# Altium schematic sheet Sheet1.SchDoc
size A; SheetNumber: 1; SheetTotal: 1
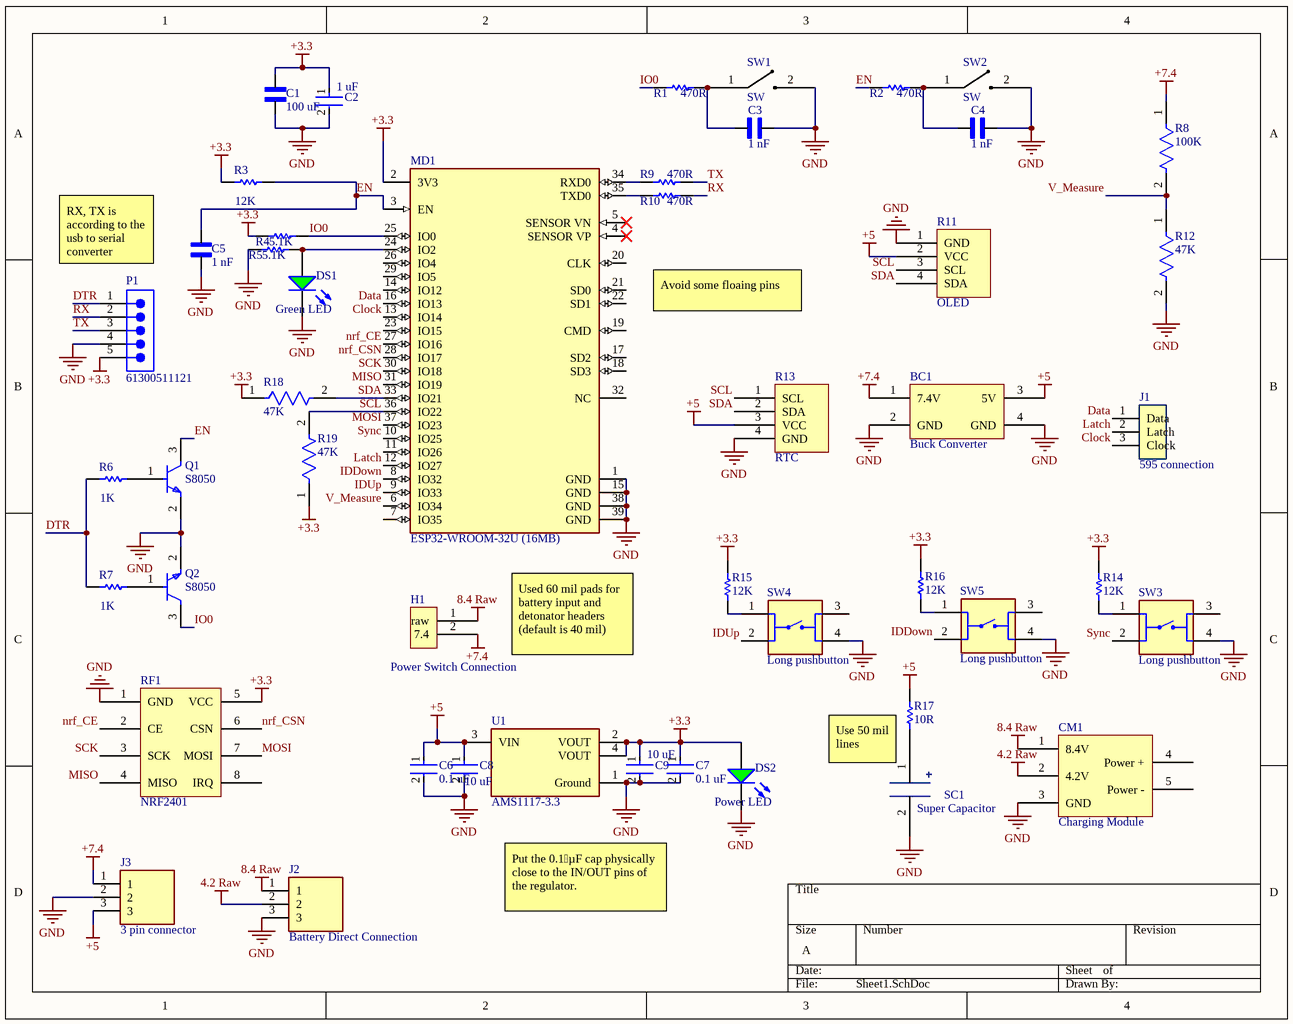
[diagram p0: Sheet1.SchDoc]

## Parts
BC1  Buck Converter  [Buck Converter]
C1  100 uF  [0805 CAP]
C2  1 uF  [FP-CL21-IPC_A]
C3  1 nF  [0805 CAP]
C4  1 nF  [0805 CAP]
C5  1 nF  [0805 CAP]
C6  0.1 uF  [FP-CC0805-0_85-MFG]
C7  0.1 uF  [FP-CC0805-0_85-MFG]
C8  10 uF  [FP-CL21-IPC_A]
C9  10 uF  [FP-CL21-IPC_A]
CM1  Charging Module  [2S Charging Module]
DS1  Green LED  [DIAL-0805-2_V]
DS2  Power LED  [DIAL-0805-2_V]
H1  Power Switch Connection  [2 Pin Header L]
J1  595 connection  [3 pin header]
J2  Battery Direct Connection  [3 pin connector]
J3  3 pin connector  [3 pin connector]
MD1  ESP32-WROOM-32U (16MB)  [FP-ESP32-WROOM-32U_16MB-MFG]
P1  61300511121  [61300511121]
Q1  S8050  [FP-SOT23-IPC_A]
Q2  S8050  [FP-SOT23-IPC_A]
R1  470R  [RESC2013X50X30LL20T20]
R2  470R  [RESC2013X50X30LL20T20]
R3  12K  [RESC2013X50X30LL20T20]
R4  5.1K  [RESC2013X50X30LL20T20]
R5  5.1K  [RESC2013X50X30LL20T20]
R6  1K  [RESC2013X50X30LL20T20]
R7  1K  [RESC2013X50X30LL20T20]
R8  100K  [FP-RC0805-0_6-MFG]
R9  470R  [RESC2013X50X30LL20T20]
R10  470R  [RESC2013X50X30LL20T20]
R11  OLED  [OLED]
R12  47K  [FP-CRCW0805-e3-MFG]
R13  RTC  [RTC]
R14  12K  [RESC2013X50X30LL20T20]
R15  12K  [RESC2013X50X30LL20T20]
R16  12K  [RESC2013X50X30LL20T20]
R17  10R  [RESC2013X50X30LL20T20]
R18  47K  [FP-CRCW0805-e3-MFG]
R19  47K  [FP-CRCW0805-e3-MFG]
RF1  NRF2401  [nrf2401]
SC1  Super Capacitor  [Super Capacitor]
SW1  SW  [smd push button 2]
SW2  SW  [smd push button 2]
SW3  Long pushbutton  [TH PB]
SW4  Long pushbutton  [TH PB]
SW5  Long pushbutton  [TH PB]
U1  AMS1117-3.3  [FP-AMS1117-IPC_C]

## Nets
4.2 Raw: CM1.2(4.2V) J2.2
8.4 Raw: CM1.1(8.4V) H1.1(raw) J2.1
+3.3: C1.2 C2.1 C7.1 C9.1 DS2.1(A) MD1.2(3V3) P1.5 R3.1 R4.1 R14.2 R15.2 R16.2 R18.1 R19.1 RF1.5(VCC) U1.2(VOUT) U1.4(VOUT)
+5: BC1.3(5V) C6.1 C8.1 J3.3 R11.2(VCC) R13.3(VCC) R17.2 U1.3(VIN)
+7.4: BC1.1(7.4V) H1.2(7.4) J3.1 R8.1
GND: BC1.2(GND) BC1.4(GND) C1.1 C2.2 C3.1 C4.1 C5.1 C6.2 C7.2 C8.2 C9.2 CM1.3(GND) DS1.2(K) DS2.2(K) J2.3 J3.2 MD1.1(GND) MD1.15(GND) MD1.38(GND) MD1.39(GND) P1.4 Q1.2(E) Q2.2(E) R5.1 R11.1(GND) R12.2 R13.4(GND) RF1.1(GND) SC1.2 SW1.2 SW2.2 SW3.4 SW4.4 SW5.4 U1.1(Ground)
Clock: J1.3(Clock) MD1.13(IO14)
Data: J1.1(Data) MD1.16(IO13)
DTR: P1.1 R6.1 R7.1
EN: C5.2 MD1.3(EN) Q1.3(C) R2.1 R3.2
IDDown: MD1.8(IO32) SW5.2
IDUp: MD1.9(IO33) SW4.2
IO0: MD1.25(IO0) Q2.3(C) R1.1 R4.2
Latch: J1.2(Latch) MD1.12(IO27)
MISO: MD1.31(IO19) RF1.4(MISO)
MOSI: MD1.37(IO23) RF1.7(MOSI)
nrf_CE: MD1.27(IO16) RF1.2(CE)
nrf_CSN: MD1.28(IO17) RF1.6(CSN)
RX: P1.2 R10.2
SCK: MD1.30(IO18) RF1.3(SCK)
SCL: MD1.36(IO22) R11.3(SCL) R13.1(SCL) R19.2
SDA: MD1.33(IO21) R11.4(SDA) R13.2(SDA) R18.2
Sync: MD1.10(IO25) SW3.2
TX: P1.3 R9.2
V_Measure: MD1.6(IO34) R8.2 R12.1
NetC3_2: C3.2 R1.2 SW1.1
NetC4_2: C4.2 R2.2 SW2.1
NetDS1_1: DS1.1(A) MD1.24(IO2) R5.2
NetMD1_34: MD1.34(RXD0) R9.1
NetMD1_35: MD1.35(TXD0) R10.1
NetQ1_1: Q1.1(B) R6.2
NetQ2_1: Q2.1(B) R7.2
NetR14_1: R14.1 SW3.1
NetR15_1: R15.1 SW4.1
NetR16_1: R16.1 SW5.1
NetR17_1: R17.1 SC1.1

Not connected (* = marked no-connect by the designer): CM1 4(Power_+) 5(Power_-); MD1 4(SENSOR_VP)* 5(SENSOR_VN)* 7(IO35) 11(IO26) 14(IO12) 17(SD2) 18(SD3) 19(CMD) 20(CLK) 21(SD0) 22(SD1) 23(IO15) 26(IO4) 29(IO5) 32(NC); RF1 8(IRQ); SW3 3; SW4 3; SW5 3

## Notes on the sheet
- RX, TX is according to the usb to serial converter
- Avoid some floaing pins
- Used 60 mil pads for battery input and detonator headers (default is 40 mil)
- (near R17) Use 50 mil lines
- Put the 0.1 µF cap physically close to the IN/OUT pins of the regulator.

## Library data of the parts
C1 C3-C5 = 0805 cap: 10000 pF Â±5% 16V Ceramic Capacitor X7R 0805 (2012 Metric); MF: AVX; MP: 0805YC103J4T2A; SnapEDA_Link: https://www.snapeda.com/parts/0805YC103J4T2A/AVX/view-part/?ref=snap; Package: 2012 AVX; Check_prices: https://www.snapeda.com/parts/0805YC103J4T2A/AVX/view-part/?ref=eda
  C1: Value: 100 uF; JLC: C141660
  C3-C5: Value: 1 nF; JLC: C1791
C2 C8 C9 = CMP-13271-002975-1: CL21 Series 0805 10uF 25V ±10% Tolerance X5R Multilayer Ceramic Chip Capacitor; Case Code (Imperial): 0805; Length: 2mm; Case/Package: 0805; Packaging: Tape and Reel; Width: 0.049inch; Tolerance: 10%; Mount: Surface Mount; Min Operating Temperature: -55°C; Thickness: 0.057inch; Height: 1.25mm; Dielectric: X5R; Package Quantity: 1; Depth: 1.25mm; Voltage Rating: 25V; Case Code (Metric): 2012; Max Operating Temperature: 85°C; Radiation Hardening: No
  C2: Capacitance: 1 uF; JLC: C385977
  C8 C9: Capacitance: 10uF; JLC: C15850
C6 C7 = CMP-2100-03606-3: CAP CER 0.1UF 50V X7R 0805; Manufacturer Part Number: CC0805KRX7R9BB104; Manufacturer: Yageo; Tolerance: 0.1; Capacitance: 100 nF; Value: 100 nF; Material: Ceramic; Device Class L1: Passive Components; ComponentLink2Description: Datasheet; Package: CC0805-0.85; Digikey Description: CAP CER 0.1UF 50V X7R 0805; Device Class L3: Ceramic Capacitors; Temperature: -30°C to +85°C; Temperature Characteristic: X7R; Voltage Rating: 50 V; Height: 0.95mm; RoHS: TRUE; Ipc Land Pattern Name: CAPC200125X85; Device Class L2: Capacitors; Category: Cap; Temperature Range Low: -30°C; Temperature Range High: +85°C; Mouser Description: Multilayer Ceramic Capacitors MLCC - SMD/SMT 100nF 50V X7R 10%; Footprint Url: http://www.yageo.com/exep/pages/download/literatures/UPY-C_GEN_24.pdf; Automotive: No; Octopart: https://octopart.com/cc0805krx7r9bb104-yageo-192993; Lead Free: Yes; ComponentLink2URL: http://www.yageo.com/documents/recent/UPY-GPHC_Y5V_6.3V-to-50V_8.pdf; JLC: C476766
CM1 = 2S Charging module
DS1 DS2 = CMP-2000-05655-1: Single Color, 2 V, -30 to 85 degC, 2-Pin SMD (0805), RoHS, Tape and Reel; Manufacturer: Dialight; Main Category: ChipLED; Shape Type: Rectangular; Forward Current: 25mA; Product Length (mm): 2mm; Emitting Color: YellowGreen; Test Current (It): 20mA; Number of  Elements: 1; Luminous Intensity: 20mcd; DELETED: Compliant; Reverse Voltage: 5V; Chip Material: GaP; High Brightness: No; Viewing Angle: 140deg; Dominant Wave Length: 570nm; Type: Uni-Color; Product Depth (mm): 1.25mm; Power Dissipation: 60W; Product Height (mm): 0.7mm; Forward Voltage: 2.4V; Lens Dimensions: 1.4x1.25x0.4mm; Pin Count: 2; Datasheet URL: https://datasheet.ciiva.com/22748/1484480-22748121.pdf; Operating Temperature Classification: Commercial; Package Reference: 0805; Operating Temp Range: -30Cto85C; Mounting: SurfaceMount; Mounting Technology: SurfaceMount; Manufacturer URL: http://www.dialight.com/; Package Description: 2-Pin Surface Mount Device, Body 2 x 1.25 mm; Lum Intensity: 20mcd; Datasheet Version: 10/2008; Rad Hardened: No; Packaging: TapeandReel; Package Type: SMD; JLC: C2297
H1 = 2 pin header
J1 = 3 pin header: 3P,STRAIGHT,SIDE ENTRY,3.5MM; MF: TE Connectivity; MP: 1546551-3; Price: None; SnapEDA_Link: https://www.snapeda.com/parts/1546551-3/TE%20Connectivity%20AMP%20Connectors/view-part/2360652/?ref=snap; Availability: Unavailable; Value: *; Package: None
J2 J3 = 3 pin connector: 3P,STRAIGHT,SIDE ENTRY,3.5MM; MF: TE Connectivity; MP: 1546551-3; Price: None; SnapEDA_Link: https://www.snapeda.com/parts/1546551-3/TE%20Connectivity%20AMP%20Connectors/view-part/2360652/?ref=snap; Availability: Unavailable; Value: *; Package: None
MD1 = CMP-194065-000029-1: RX TXRX MODULE WIFI U.FL SMD; Sensitivity: -98dBm; Frequency: 2.5GHz; Memory Size: 536KB; Data Rate: 150Mbps; Interface: I2C; Packaging: Tape and Reel; Case/Package: SMD/SMT; Max Operating Temperature: 85°C; Mount: Surface Mount; Min Operating Temperature: -40°C; JLC: C328062
P1 = CMP-1502-01068-3: NexarPartId: 32855526; Connector Type: Male Pin; Gender: Male; Contact Resistance: 20mΩ; Pitch: 2.54mm; Operating Supply Voltage: 250V; Current Rating: 3A; Number of Contacts: 5; Lead Free: Lead Free; Color: Black; Packaging: Bulk; Lead Pitch: 2.54mm; Contact Material: Copper; Min Operating Temperature: -40°C; Contact Mating Length: 5.9944mm; Voltage Rating: 250V; Number of Pins: 5; Number of Positions: 5; Height: 8.89mm; Orientation: Vertical; REACH SVHC: Unknown; RoHS: Compliant; Contact Plating: Gold; Max Operating Temperature: 105°C; Mount: Through Hole; Number of Rows: 1; Termination: Solder
Q1 Q2 = CMP-2000-04931-2: TRANS NPN 40V 0.2A SMD SOT23-3; Frequency: 300MHz; Power Dissipation: 350mW; Element Configuration: Single; Max Power Dissipation: 300mW; Max Collector Current: 200mA; Collector Emitter Saturation Voltage: 300mV; Number of Elements: 1; hFE Min: 100; Collector Base Voltage (VCBO): 60V; Emitter Base Voltage (VEBO): 6V; Contact Plating: Tin; Package Quantity: 3000; Max Frequency: 300MHz; REACH SVHC: No SVHC; Max Operating Temperature: 150°C; Width: 1.4mm; Collector Emitter Voltage (VCEO): 40V; Voltage Rating (DC): 40V; Radiation Hardening: No; Case/Package: SOT-23; Height: 1mm; Collector Emitter Breakdown Voltage: 40V; Length: 3.05mm; Polarity: NPN; Packaging: Tape and Reel; Number of Pins: 3; Min Operating Temperature: -55°C; Gain Bandwidth Product: 300MHz; Mount: Surface Mount; Weight: 0.000282oz; Continuous Collector Current: 200mA; Transition Frequency: 300MHz; Max Breakdown Voltage: 40V; Lead Free: Lead Free; JLC: C41095
R1-R7 R9 R10 R14-R17 = CMP-2001-04896-1: Manufacturer: Vishay Dale; Part Number: CRCW08050000Z0EA
  R1 R2 R9 R10: JLC: C17710
  R3 R14-R16: JLC: C17444
  R4 R5: JLC: C27834
  R6 R7: JLC: C17513
  R17: JLC: C17415
R8 = CMP-03412-037835-1: RES SMD 100K OHM 5% 1/8W 0805; Voltage Rating: 150V; Power Rating: 125mW; Temperature Coefficient: 100ppm/°C; Resistance: 100kR; Radiation Hardening: No; Lead Free: Lead Free; Size Code: 0805; Resistance Tolerance: 5%; Case Code (Imperial): 0805; Min Operating Temperature: -55°C; Packaging: Tape and Reel; Termination: SMD/SMT; Number of Terminations: 2; RoHS Compliant: Yes; Features: Moisture Resistant; Construction: Rectangular; Series: RC; Max Operating Temperature: 155°C; Military Standard: Not; Depth: 1.25mm; Contact Plating: Tin; Tolerance: 5%; Max Power Dissipation: 125mW; Length: 2mm; Case Code (Metric): 2012; Resistor Type: Thick Film; Case/Package: 0805; JLC: C149504
R12 R18 R19 = CMP-2001-03939-2: RES Thick Film, 47kΩ, 1%, 0.125W, 100ppm/°C, 0805; Resistance: 47kR; Voltage Rating: 150V; Max Power Dissipation: 125mW; Termination: SMD/SMT; Case Code (Imperial): 0805; Number of Terminations: 2; Contact Plating: Tin; Min Operating Temperature: -55°C; Features: Automotive AEC-Q200; Temperature Coefficient: 100ppm/°C; Case/Package: 0805; Composition: Thick Film; Working Voltage: 150V; Width: 1.25mm; Package Quantity: 10; Lead Free: Lead Free; Radiation Hardening: No; Power Rating: 125mW; Military Standard: Not; Height: 0.45mm; Weight: 0.000194oz; Length: 2mm; Depth: 1.25mm; Voltage Rating (DC): 150V; Packaging: Tape and Reel; Case Code (Metric): 2012; Max Operating Temperature: 155°C; Tolerance: 1%; JLC: C17713
SW1 SW2 = push button smd: JLC: C720477
SW3-SW5 = TH PB: Switch Push Button OFF (ON) SPST Round Button 0.05A 24VDC Momentary Contact PC Pins Thru-Hole; MP: 1825910-6; MF: TE Connectivity; Value: *; Package: None; Check_prices: https://www.snapeda.com/parts/1825910-6/TE+Connectivity+ALCOSWITCH+Switches/view-part/?ref=eda; SnapEDA_Link: https://www.snapeda.com/parts/1825910-6/TE+Connectivity+ALCOSWITCH+Switches/view-part/?ref=snap; Digi-Key_Part_Number: 450-1650-ND; Purchase-URL: https://pricing.snapeda.com/search/part/1825910-6/?ref=eda
U1 = CMP-209535-000001-1: LDO Voltage Regulators 1A, 3.3V; Manufacturer: Advanced Monolithic Systems; Dropout Voltage: 1.1V; Output Type: Fixed; Nominal Supply Current: 5mA; Max Power Dissipation: 1.2W; Max Supply Voltage: 15V; Number Of Outputs: 1; Standoff Height: 0.64mm; Max Junction Temp: +125°C; Height: 1.8mm; Package: AMS1117; Device Class L2: Power Management ICs; ComponentLink2Description: Datasheet; ComponentLink2URL: http://www.advanced-monolithic.com/pdf/ds1117.pdf; Category: IC; RoHS: TRUE; Automotive: No; Device Class L1: Integrated Circuits (ICs); Output Current: 1A; Device Class L3: Voltage Regulators - Linear; Temperature: -40°C to +125°C; Output Voltage: 3.3V; Manufacturer Part Number: AMS1117-3.3; Temperature Range Low: -40°C; Octopart: https://octopart.com/ams1117-3.3-advanced+monolithic+systems-25899300; Lead Free: Yes; Ipc Land Pattern Name: SOT229P700X180-4; Temperature Range High: +125°C; JLC: C6188